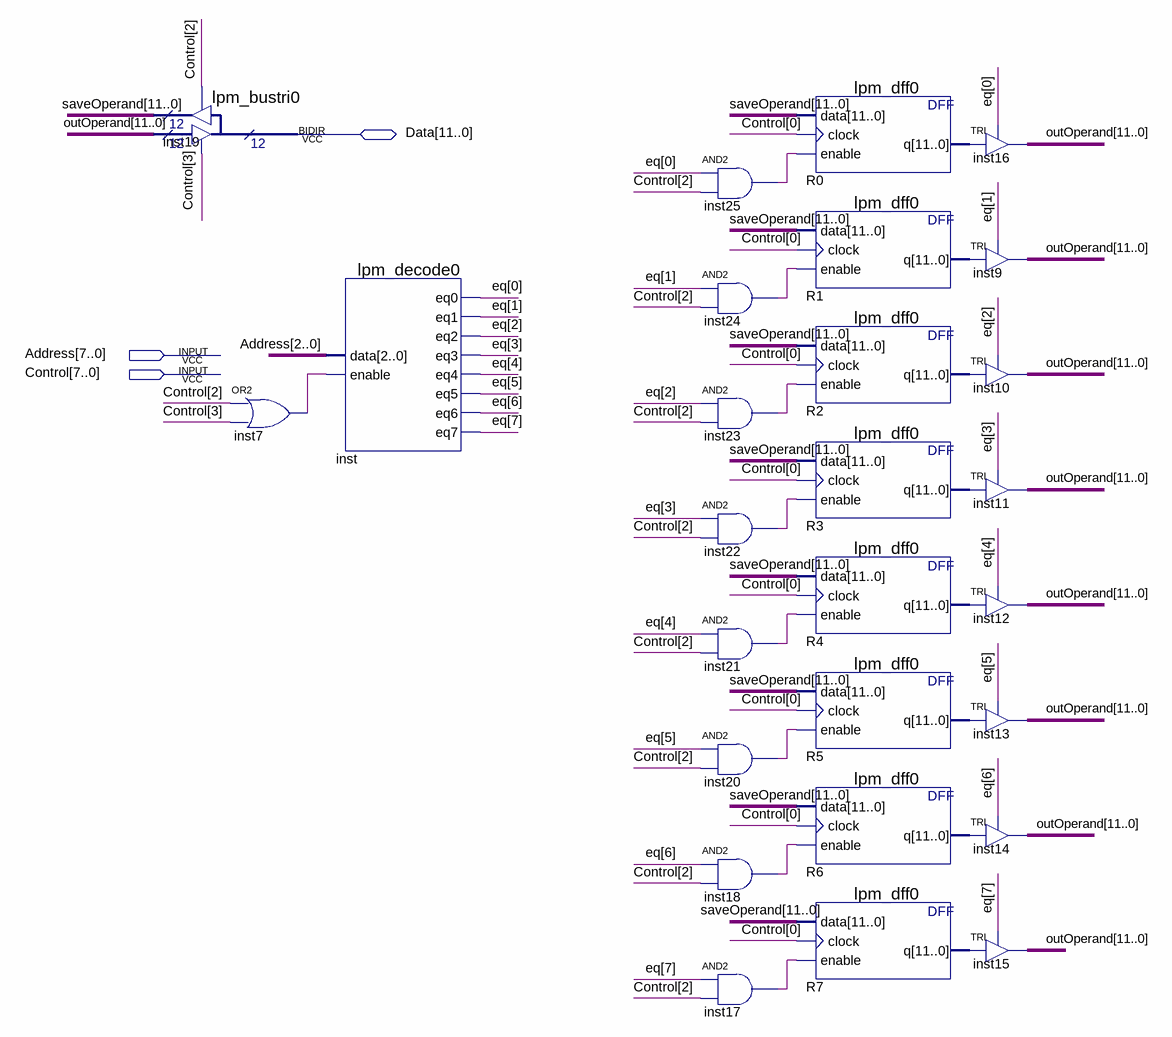
[diagram p0: schematic sheet]
// Quartus schematic gpr.bdf as structural Verilog: 27 symbols, 3 pins
module gpr (
  input  [7:0] Address,
  input  [7:0] Control,
  inout  [11:0] Data
);

  wire inst7_out, inst17_out, inst18_out, inst20_out, inst21_out, inst22_out, inst23_out, inst24_out,
       inst25_out;
  wire [7:0] eq;
  wire [11:0] outOperand, R0_q, R1_q, R2_q, R3_q, R4_q, R5_q, R6_q, R7_q, saveOperand;

  lpm_bustri0 inst19 (
    .enabledt(Control[3]), .data(outOperand), .enabletr(Control[2]), .result(saveOperand), .tridata(Data));
  or inst7 (inst7_out, Control[2], Control[3]);
  lpm_decode0 inst (
    .data(Address[2:0]), .enable(inst7_out), .eq0(eq[0]), .eq1(eq[1]), .eq2(eq[2]), .eq3(eq[3]), .eq4(eq[4]),
    .eq5(eq[5]), .eq6(eq[6]), .eq7(eq[7]));
  and inst25 (inst25_out, eq[0], Control[2]);
  and inst24 (inst24_out, eq[1], Control[2]);
  and inst23 (inst23_out, eq[2], Control[2]);
  and inst22 (inst22_out, eq[3], Control[2]);
  and inst21 (inst21_out, eq[4], Control[2]);
  and inst20 (inst20_out, eq[5], Control[2]);
  and inst18 (inst18_out, eq[6], Control[2]);
  and inst17 (inst17_out, eq[7], Control[2]);
  lpm_dff0 R0 (.data(saveOperand), .clock(Control[0]), .enable(inst25_out), .q(R0_q));
  lpm_dff0 R1 (.data(saveOperand), .clock(Control[0]), .enable(inst24_out), .q(R1_q));
  lpm_dff0 R2 (.data(saveOperand), .clock(Control[0]), .enable(inst23_out), .q(R2_q));
  lpm_dff0 R3 (.data(saveOperand), .clock(Control[0]), .enable(inst22_out), .q(R3_q));
  lpm_dff0 R4 (.data(saveOperand), .clock(Control[0]), .enable(inst21_out), .q(R4_q));
  lpm_dff0 R5 (.data(saveOperand), .clock(Control[0]), .enable(inst20_out), .q(R5_q));
  lpm_dff0 R6 (.data(saveOperand), .clock(Control[0]), .enable(inst18_out), .q(R6_q));
  lpm_dff0 R7 (.data(saveOperand), .clock(Control[0]), .enable(inst17_out), .q(R7_q));
  TRI inst16[11:0] (.IN(R0_q), .OE(eq[0]), .OUT(outOperand));
  TRI inst9[11:0] (.IN(R1_q), .OE(eq[1]), .OUT(outOperand));
  TRI inst10[11:0] (.IN(R2_q), .OE(eq[2]), .OUT(outOperand));
  TRI inst11[11:0] (.IN(R3_q), .OE(eq[3]), .OUT(outOperand));
  TRI inst12[11:0] (.IN(R4_q), .OE(eq[4]), .OUT(outOperand));
  TRI inst13[11:0] (.IN(R5_q), .OE(eq[5]), .OUT(outOperand));
  TRI inst14[11:0] (.IN(R6_q), .OE(eq[6]), .OUT(outOperand));
  TRI inst15[11:0] (.IN(R7_q), .OE(eq[7]), .OUT(outOperand));
endmodule
